# EAGLE schematic schmitt_trigger (EAGLE 6.4)
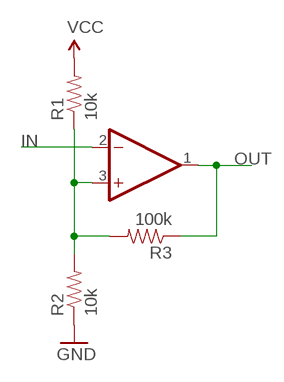
[diagram p0: schematic, sheet 1]

## Parts
IC1  MCP6022  [SOIC8_150MIL]
R1  10k  RESISTOR0402-RES  [0402-RES]
R2  10k  RESISTOR0402-RES  [0402-RES]
R3  100k  RESISTOR0402-RES  [0402-RES]

## Nets
GND: R2.1
IN: IC1.2(-IN)
N$1: IC1.3(+IN) R1.1 R2.2 R3.2
OUT: IC1.1(OUT) R3.1
VCC: R1.2
Unconnected: IC1.4(-) IC1.5(+IN) IC1.6(-IN) IC1.7(OUT) IC1.8(+)

## Library data of the parts
IC1 = microbuilder:MCP6022: MCP6022 - Dual Rail-to-Rail 10MHz Op-Amp Digikey: SOIC8 - MCP6022-I/SN-ND
R1-R3 = SparkFun-Passives:RESISTOR: Resistor Basic schematic elements and footprints for 0603, 1206, and PTH resistors.